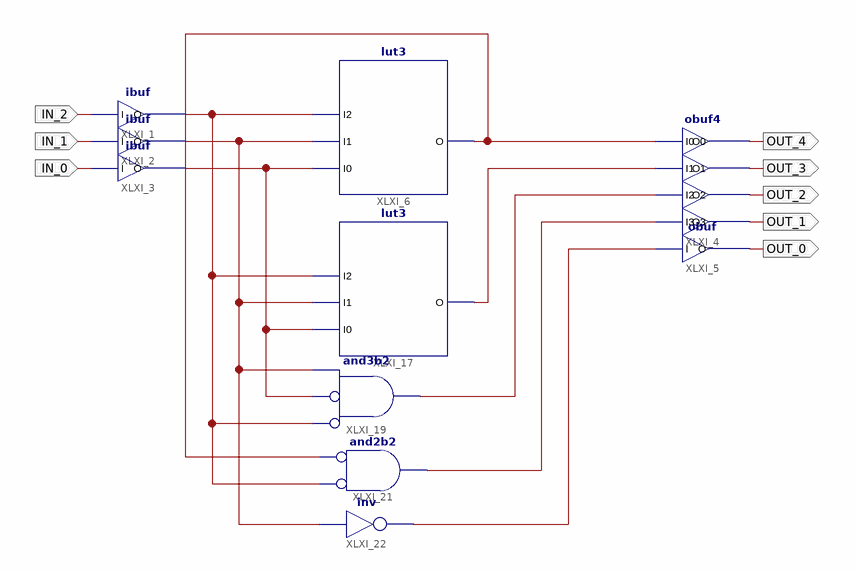
[diagram p0: schematic sheet 1]
// Xilinx ISE schematic Decoder3To5.sch (spartan3a) as structural Verilog: 10 symbols, 8 ports
module Decoder3To5 (
  input  IN_2,
  input  IN_1,
  input  IN_0,
  output OUT_4,
  output OUT_3,
  output OUT_2,
  output OUT_1,
  output OUT_0
);

  wire XLXN_28, XLXN_29, XLXN_30, XLXN_31, XLXN_33, XLXN_48, XLXN_51, XLXN_52;

  obuf4 XLXI_4 (.I0(XLXN_48), .I1(XLXN_28), .I2(XLXN_33), .I3(XLXN_51), .O0(OUT_4), .O1(OUT_3), .O2(OUT_2), .O3(OUT_1));
  obuf XLXI_5 (.I(XLXN_52), .O(OUT_0));
  ibuf XLXI_1 (.I(IN_2), .O(XLXN_31));
  ibuf XLXI_2 (.I(IN_1), .O(XLXN_30));
  ibuf XLXI_3 (.I(IN_0), .O(XLXN_29));
  lut3 #(.INIT("09")) XLXI_6 (.I0(XLXN_29), .I1(XLXN_30), .I2(XLXN_31), .O(XLXN_48));
  lut3 #(.INIT("67")) XLXI_17 (.I0(XLXN_29), .I1(XLXN_30), .I2(XLXN_31), .O(XLXN_28));
  and XLXI_19 (XLXN_33, ~XLXN_31, ~XLXN_29, XLXN_30);  // and3b2
  and XLXI_21 (XLXN_51, ~XLXN_31, ~XLXN_48);  // and2b2
  not XLXI_22 (XLXN_52, XLXN_30);
endmodule
